# Altium schematic sheet CON_AUDIO_AC99_NOMIC.SchDoc: AUDIO AC99 Interface
size A4; Organization: Altium Limited.; Address1: Level 3, 12a Rodborough Rd; Address2: Frenchs Forest 2086; Address3: NSW; Address4: AUSTRALIA; SheetNumber: 1; SheetTotal: 100
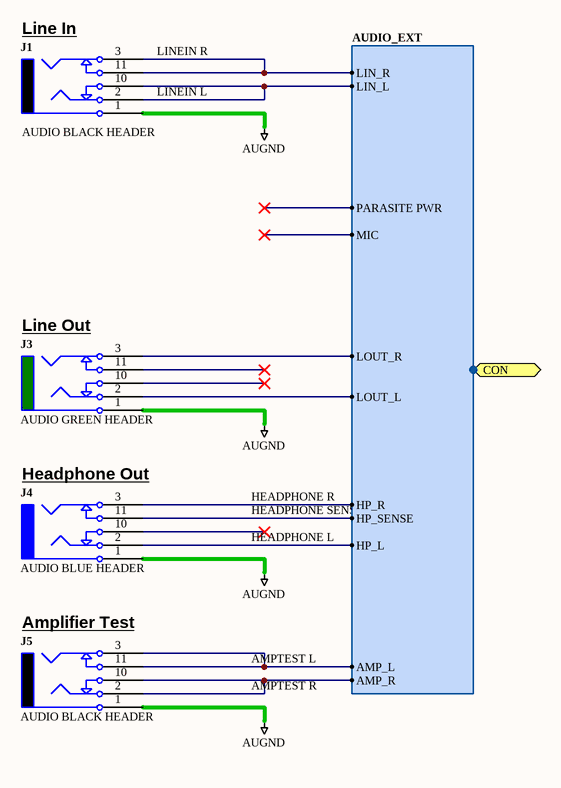
[diagram p0: CON_AUDIO_AC99_NOMIC.SchDoc]

## Parts
J1  AUDIO BLACK HEADER  [TSH-3675]
J3  AUDIO GREEN HEADER  [TSH-3675]
J4  AUDIO BLUE HEADER  [TSH-3675]
J5  AUDIO BLACK HEADER  [TSH-3675]

## Ports
CON (harness AUDIO_EXT)

## Harnesses
AUDIO_EXT: AMP_L, AMP_R, HP_L, HP_R, HP_SENSE, LIN_L, LIN_R, LOUT_L, LOUT_R, MIC, PARASITE PWR

## Nets
AUGND: J1.1 J3.1 J4.1 J5.1
NetJ1_2: J1.2 J1.10 ; port CON.LIN_L
NetJ1_3: J1.3 J1.11 ; port CON.LIN_R
NetJ3_2: J3.2 ; port CON.LOUT_L
NetJ3_3: J3.3 ; port CON.LOUT_R
NetJ4_2: J4.2 ; port CON.HP_L
NetJ4_3: J4.3 ; port CON.HP_R
NetJ4_11: J4.11 ; port CON.HP_SENSE
NetJ5_2: J5.2 J5.10 ; port CON.AMP_R
NetJ5_3: J5.3 J5.11 ; port CON.AMP_L

Not connected (* = marked no-connect by the designer): J3 10* 11*; J4 10*

## Notes on the sheet
- (near J1) Line In
- LINEIN R
- LINEIN L
- (near J3) Line Out
- (near J4) Headphone Out
- HEADPHONE R
- HEADPHONE L
- HEADPHONE SENSE
- (near J5) Amplifier Test
- AMPTEST L
- AMPTEST R
- Sheet Title
- Project Title
- Size:
- Date:
- A4
- Assy:
- Time:
- Revision:
- Sheet
- of
- File:

## Library data of the parts
J1 J5 = D-300-0033: Connector, 3.5mm Stereo Audio Socket, Black, 2 break contacts (normals) and 2 auxiliary make contacts; Category: Connector; Connector type: AUDIO BLACK HEADER; Status: Production
J3 = D-300-0031: Connector, 3.5mm Stereo Audio Socket, Green, 2 break contacts (normals) and 2 auxiliary make contacts; Category: Connector; Connector type: AUDIO GREEN HEADER; Status: Production
J4 = D-300-0032: Connector, 3.5mm Stereo Audio Socket, Blue, 2 break contacts (normals) and 2 auxiliary make contacts; Category: Connector; Connector type: AUDIO BLUE HEADER; Status: Production